# Altium schematic sheet Interfaces.SchDoc
size A4; SheetNumber: 3; SheetTotal: 4
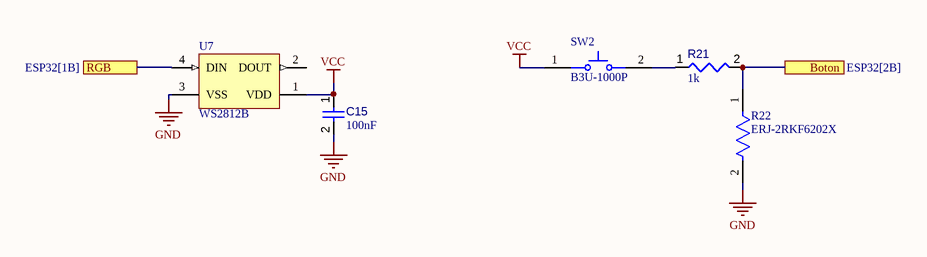
[diagram p0: Interfaces.SchDoc]

## Parts
C15  value 100nF  [CAPC1005X56X25LL10T15]  (hidden comment: Capacitor 0.1 uF +/- 5% 16 V 0402)
R21  value 1k  [RESC0402(1005)_L]  (hidden comment: Resistor 1K +/-5 % 0402 63 mW)
R22  ERJ-2RKF6202X  [FP-ERJ2RK-MFG]
SW2  B3U-1000P  [OMRON-B3U-1000_V]
U7  WS2812B  [ADAI-WS2812B_V]

## Ports
Boton (see ESP32[2B]), RGB (see ESP32[1B])

## Nets
GND: C15.2 R22.2 U7.3(VSS)
VCC: C15.1 SW2.1 U7.1(VDD)
Boton: R21.2 R22.1 ; port Boton
RGB: U7.4(DIN) ; port RGB
NetR21_1: R21.1 SW2.2

Not connected (* = marked no-connect by the designer): U7 2(DOUT)

## Library data of the parts
C15 = CMP-001-00001-6: Chip Capacitor, 0.1 uF, +/- 5%, 16 V, 0402 (1005 Metric); Capacitor Type: Ceramic; Voltage Rating: 16V; Max Operating Temperature: 125°C; Min Operating Temperature: -55°C; Case/Package: 0402; Mounting Technology: SM; Pins: 2; Tolerance: 5%; RoHS Compliant: True
R21 = CMP-009-00157-3: Chip Resistor, 1 kOhms, +/-5 %, 63 mW, -55 to 155 degC, 0402; Tolerance: 5%; Power: 63mW; Case/Package: 0402; Pins: 2; Min Operating Temperature: -55°C; Max Operating Temperature: 155°C
R22 = CMP-2002-01165-2: NexarPartId: 55404988; Voltage Rating (DC): 50V; Power Rating: 100mW; Temperature Coefficient: 100ppm/°C; Resistance: 62kΩ; Tolerance: 1%; Min Operating Temperature: -55°C; RoHS: Compliant; Case/Package: 0402; Composition: Thick Film; Lead Free: Lead Free; Packaging: Cut Tape; Mount: Surface Mount; Contact Plating: Tin; Depth: 500µm; Schedule B: 8533210045, 8533210045; Max Operating Temperature: 155°C; Termination: SMD/SMT; Case Code (Imperial): 0402; Features: Automotive AEC-Q200; Max Power Dissipation: 100mW; Voltage Rating: 50V; Military Standard: Not; Number of Terminations: 2; Lifecycle Status: Production; REACH SVHC: No SVHC; Length: 1mm; Width: 508µm; Case Code (Metric): 1005; Height: 350µm
SW2 = CMP-011-00000-2: Tactile Switch, SPST-NO, 0.05 A, 12 V, -25 to 70 degC, 2-Pin SMD, RoHS, Tape and Reel; Manufacturer: Omron Electronic Components; IP Rating: IP40; Current Rating: 50mA; Max Contact Resistance: 100mohm; Operating Force: 153gf; Throw Configuration: SPST; Resistance: 0.1Ohm; Max Voltage Rating (DC): 12V; Contact Material: Silver; Max Current Rating: 50mA; Datasheet URL: http://www.omron.com/ecb/products/pdf/en-b3u.pdf; Mounting Technology: SM; Case/Package: B3U-1000; Packaging: TapeandReel; Package Reference: B3U-1000; Manufacturer URL: http://www.omron.com/; Datasheet Version: Jan-15; RoHS Compliant: True; Max Operating Temperature: 70°C; Contact Current Rating: 50mA; Package Quantity: 3500; Package Description: 2-Pin Surface Mount Device, Body 3 x 2.5 mm; Voltage Rating (DC): 12V; Min Operating Temperature: -25°C; Voltage Rating: 12V
U7 = CMP-007-00035-2: Intelligent Control LED Integrated Light Source, 3.5 to 5.3 V, -25 to 80 degC, 4-Pin SMD, RoHS, Bulk; Manufacturer: Adafruit Industries; Datasheet URL: https://cdn-shop.adafruit.com/datasheets/WS2812B.pdf; Manufacturer URL: https://www.adafruit.com/; Datasheet Version: May-13; Case/Package: WS2812B; Mounting Technology: SM; RoHS Compliant: False; Package Description: 4-Pin Surface Mount Device, Body 5 x 5 mm, Pitch 3.3 mm; Package Reference: WS2812B